# Altium schematic sheet ALU_ADDER.SchDoc
size B; Author: E. Sims; Organization: Let's Build Rockets Inc.; SheetNumber: 3; SheetTotal: 3
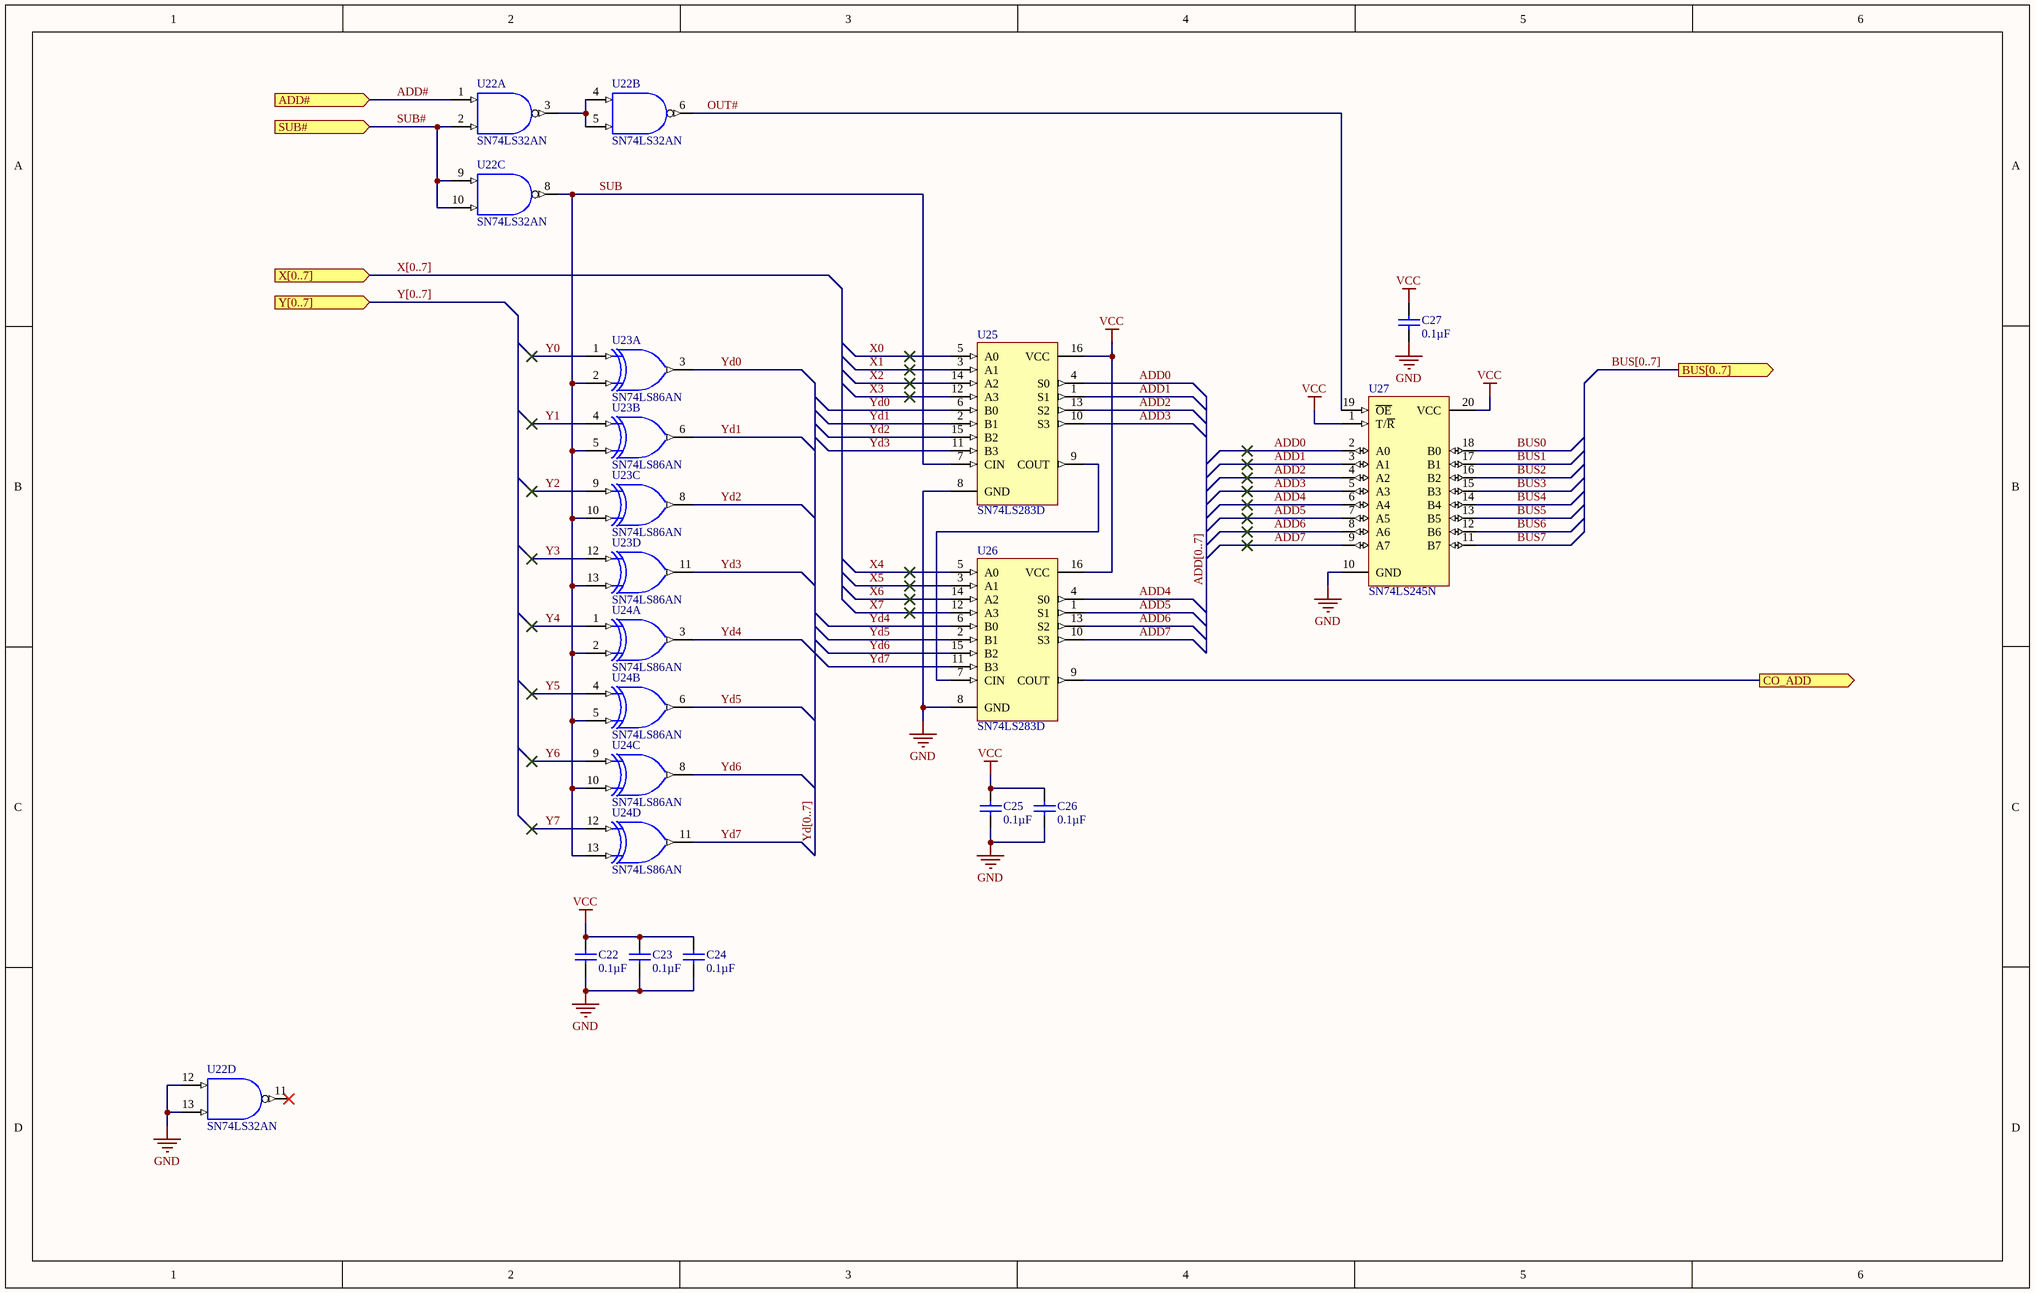
[diagram p0: ALU_ADDER.SchDoc]

## Parts
C22  Capacitance: 0.1µF  [VISH-K104K15X7RF5TL2]  (hidden comment: K104K15X7RF5TL2)
C23  Capacitance: 0.1µF  [VISH-K104K15X7RF5TL2]  (hidden comment: K104K15X7RF5TL2)
C24  Capacitance: 0.1µF  [VISH-K104K15X7RF5TL2]  (hidden comment: K104K15X7RF5TL2)
C25  Capacitance: 0.1µF  [VISH-K104K15X7RF5TL2]  (hidden comment: K104K15X7RF5TL2)
C26  Capacitance: 0.1µF  [VISH-K104K15X7RF5TL2]  (hidden comment: K104K15X7RF5TL2)
C27  Capacitance: 0.1µF  [VISH-K104K15X7RF5TL2]  (hidden comment: K104K15X7RF5TL2)
U22  SN74LS32AN  [N014]  (parts A,B,C,D of 4)
U23  SN74LS86AN  [N014]  (parts A,B,C,D of 4)
U24  SN74LS86AN  [N014]  (parts A,B,C,D of 4)
U25  SN74LS283D  [J016D]
U26  SN74LS283D  [J016D]
U27  SN74LS245N  [N020]

## Ports
ADD# (in), BUS[0..7] (out), CO_ADD (out), SUB# (in), X[0..7] (in), Y[0..7] (in)

## Nets
GND: C22.2 C23.2 C24.2 C25.2 C26.2 C27.2 U22.7(GND) U22.12(A) U22.13(B) U23.7(GND) U24.7(GND) U25.8(GND) U26.8(GND) U27.10(GND)
VCC: C22.1 C23.1 C24.1 C25.1 C26.1 C27.1 U22.14(VCC) U23.14(VCC) U24.14(VCC) U25.16(VCC) U26.16(VCC) U27.1(T/~{R}) U27.20(VCC)
ADD0: U25.4(S0) U27.2(A0)
ADD1: U25.1(S1) U27.3(A1)
ADD2: U25.13(S2) U27.4(A2)
ADD3: U25.10(S3) U27.5(A3)
ADD4: U26.4(S0) U27.6(A4)
ADD5: U26.1(S1) U27.7(A5)
ADD6: U26.13(S2) U27.8(A6)
ADD7: U26.10(S3) U27.9(A7)
ADD#: U22.1(A) ; port ADD#
BUS0: U27.18(B0)
BUS1: U27.17(B1)
BUS2: U27.16(B2)
BUS3: U27.15(B3)
BUS4: U27.14(B4)
BUS5: U27.13(B5)
BUS6: U27.12(B6)
BUS7: U27.11(B7)
CO_ADD: U26.9(COUT) ; port CO_ADD
OUT#: U22.6(Y) U27.19(~{OE})
SUB: U22.8(Y) U23.2(B) U23.5(B) U23.10(B) U23.13(B) U24.2(B) U24.5(B) U24.10(B) U24.13(B) U25.7(CIN)
SUB#: U22.2(B) U22.9(A) U22.10(B) ; port SUB#
X0: U25.5(A0)
X1: U25.3(A1)
X2: U25.14(A2)
X3: U25.12(A3)
X4: U26.5(A0)
X5: U26.3(A1)
X6: U26.14(A2)
X7: U26.12(A3)
Y0: U23.1(A)
Y1: U23.4(A)
Y2: U23.9(A)
Y3: U23.12(A)
Y4: U24.1(A)
Y5: U24.4(A)
Y6: U24.9(A)
Y7: U24.12(A)
Yd0: U23.3(Y) U25.6(B0)
Yd1: U23.6(Y) U25.2(B1)
Yd2: U23.8(Y) U25.15(B2)
Yd3: U23.11(Y) U25.11(B3)
Yd4: U24.3(Y) U26.6(B0)
Yd5: U24.6(Y) U26.2(B1)
Yd6: U24.8(Y) U26.15(B2)
Yd7: U24.11(Y) U26.11(B3)
NetU22_3: U22.3(Y) U22.4(A) U22.5(B)
NetU25_9: U25.9(COUT) U26.7(CIN)

Not connected (* = marked no-connect by the designer): U22 11(Y)*

## Buses and harness runs
bus ADD[0..7]
bus BUS[0..7] = port BUS[0..7]
bus X[0..7] = port X[0..7]
bus Y[0..7] = port Y[0..7]
bus Yd[0..7]

## Notes on the sheet
- Let's Build Rocket's Inc. Modular Paylaod System Based on TMP-010 Rev
  For more information visit https://github.com/LetsBuildRockets/Modular-Payload-System
  This work is licensed under CC BY-NC 4.0. To view a copy of this license, visit https://creativecommons.org/licenses/by-nc/4.0
- Title
- Size:
- Date:
- Assembly Variant:
- B
- Number:
- Time:
- Revision:
- Sheet
- of
- Author:
- File:

## Library data of the parts
C22-C27 = CMP-2000-06508-1: Ceramic Capacitor, 100 nF, +/- 10%, 50 V, -55 to 125 degC, 2-Pin THD, RoHS, Tape and Reel; Manufacturer: Vishay; Other Names: BC1084CT; Catalog Drawings: Mono-KapSide2-15_5.58Mono-KapSide1_15; Temperature Coefficient: X7R; Voltage - Rated: 50V; Online Catalog: Mono-Kap™Series; Size / Dimension: 0.157"Lx0.098"W(4.00mmx2.50mm); Operating Temperature: -55°C~125°C; Family: CeramicCapacitors; Manufacturer URL: http://www.vishay.com/; Standard Package: 1; Thickness (Max): -; Ratings: -; Datasheet Version: 08/2013; Package Description: 2-Pin Through Hole Device, Body 4 x 2.6 mm; Mounting Type: ThroughHole; Features: -; Lead Spacing: 0.098"(2.50mm); Tolerance: ±10%; Category: Capacitors; Mounting Technology: ThroughHole; Lead Style: Straight; Datasheet URL: http://www.vishay.com/docs/45171/kseries.pdf; Applications: GeneralPurpose; Package / Case: Radial; Height - Seated (Max): 0.220"(5.58mm); Package Reference: K104K15X7RF5TL2; Series: Mono-Kap™K; Packaging: CutTape(CT)
U22 = SN74LS00N: Quadruple 2-Input Positive-NAND Gate; Published: 8-Jun-2000; LatestRevisionDate: 04-Mar-2005; LatestRevisionNote: Stylized 3D Model Added.; DatasheetVersion: Mar-1988; PackageVersion: Oct-1995; PackageReference: N014; Publisher: Altium Limited; PackageDescription: DIP; 14 Leads; Row Spacing 7.62 mm; Pitch 2.54 mm; ComponentLink1Description: Manufacturer Link; ComponentLink1URL: http://www.ti.com/; ComponentLink2Description: Datasheet; ComponentLink2URL: http://www-s.ti.com/sc/ds/sn74ls00.pdf
U23 U24 = SN74LS86AN: Quadruple 2-Input Exclusive-OR Gate; Published: 8-Jun-2000; LatestRevisionDate: 04-Mar-2005; LatestRevisionNote: Stylized 3D Model Added.; DatasheetVersion: Mar-1988; PackageVersion: Oct-1995; PackageReference: N014; Publisher: Altium Limited; PackageDescription: DIP; 14 Leads; Row Spacing 7.62 mm; Pitch 2.54 mm; ComponentLink1Description: Manufacturer Link; ComponentLink1URL: http://www.ti.com/; ComponentLink2Description: Datasheet; ComponentLink2URL: http://www-s.ti.com/sc/ds/sn74ls86a.pdf
U25 U26 = SN74LS283D: 4-Bit Binary Full Adder with Fast Carry; Published: 8-Jun-2000; LatestRevisionDate: 04-Mar-2005; LatestRevisionNote: Stylized 3D Model Added.; DatasheetVersion: Mar-1988; PackageVersion: Jun-1999; PackageReference: J016D; Publisher: Altium Limited; PackageDescription: DIP; 16 Leads; Row Spacing 7.62 mm; Pitch 2.54 mm; ComponentLink1Description: Manufacturer Link; ComponentLink1URL: http://www.ti.com; ComponentLink2Description: Datasheet; ComponentLink2URL: http://www-s.ti.com/sc/ds/sn54ls283.pdf
U27 = SN74LS245N: Octal Bus Transceiver with 3-State Outputs; Published: 8-Jun-2000; LatestRevisionDate: 04-Mar-2005; LatestRevisionNote: Stylized 3D Model Added.; DatasheetVersion: Mar-1988; PackageVersion: Oct-1995; PackageReference: N020; Publisher: Altium Limited; PackageDescription: DIP; 20 Leads; Row Spacing 7.62 mm; Pitch 2.54 mm; ComponentLink1Description: Manufacturer Link; ComponentLink1URL: http://www.ti.com/; ComponentLink2Description: Datasheet; ComponentLink2URL: http://www-s.ti.com/sc/ds/sn74ls245.pdf